# EAGLE design motorDriver (EAGLE 8.4.1)
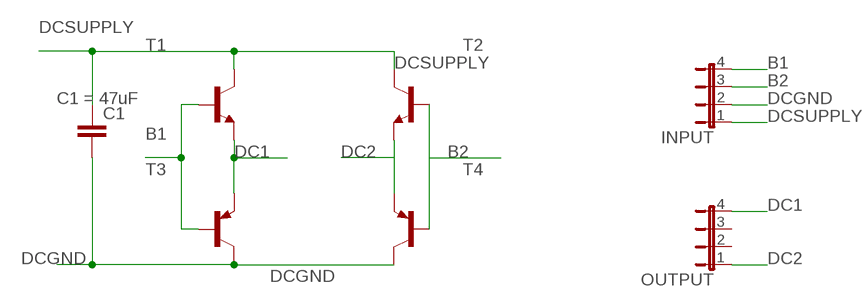
[diagram p0: schematic, sheet 1]

## Parts
C1  C5/3.5  [C5B3.5]
INPUT  JP4E  [JP4]
OUTPUT  JP4E  [JP4]
T1  -NPN-SOT93V  [SOT93V]
T2  -NPN-SOT93V  [SOT93V]
T3  -PNP-SOT93V  [SOT93V]
T4  -PNP-SOT93V  [SOT93V]

## Nets
B1: INPUT.4 T1.B T3.B
B2: INPUT.3 T2.B T4.B
DC1: OUTPUT.4 T1.E T3.E
DC2: OUTPUT.1 T2.E T4.E
DCGND: C1.2 INPUT.2 T3.C T4.C
DCSUPPLY: C1.1 INPUT.1 T1.C T2.C
Unconnected: OUTPUT.2 OUTPUT.3

## Library data of the parts
C1 = capacitor-wima:C: CAPACITOR naming: grid - package width; C1: 47uF
INPUT OUTPUT = jumper:JP4E: JUMPER
T1 T2 = transistor:*-NPN-: NPN Transistror BF959 corrected 2008.03.06
T3 T4 = transistor:*-PNP-: PNP Transistror

## Board
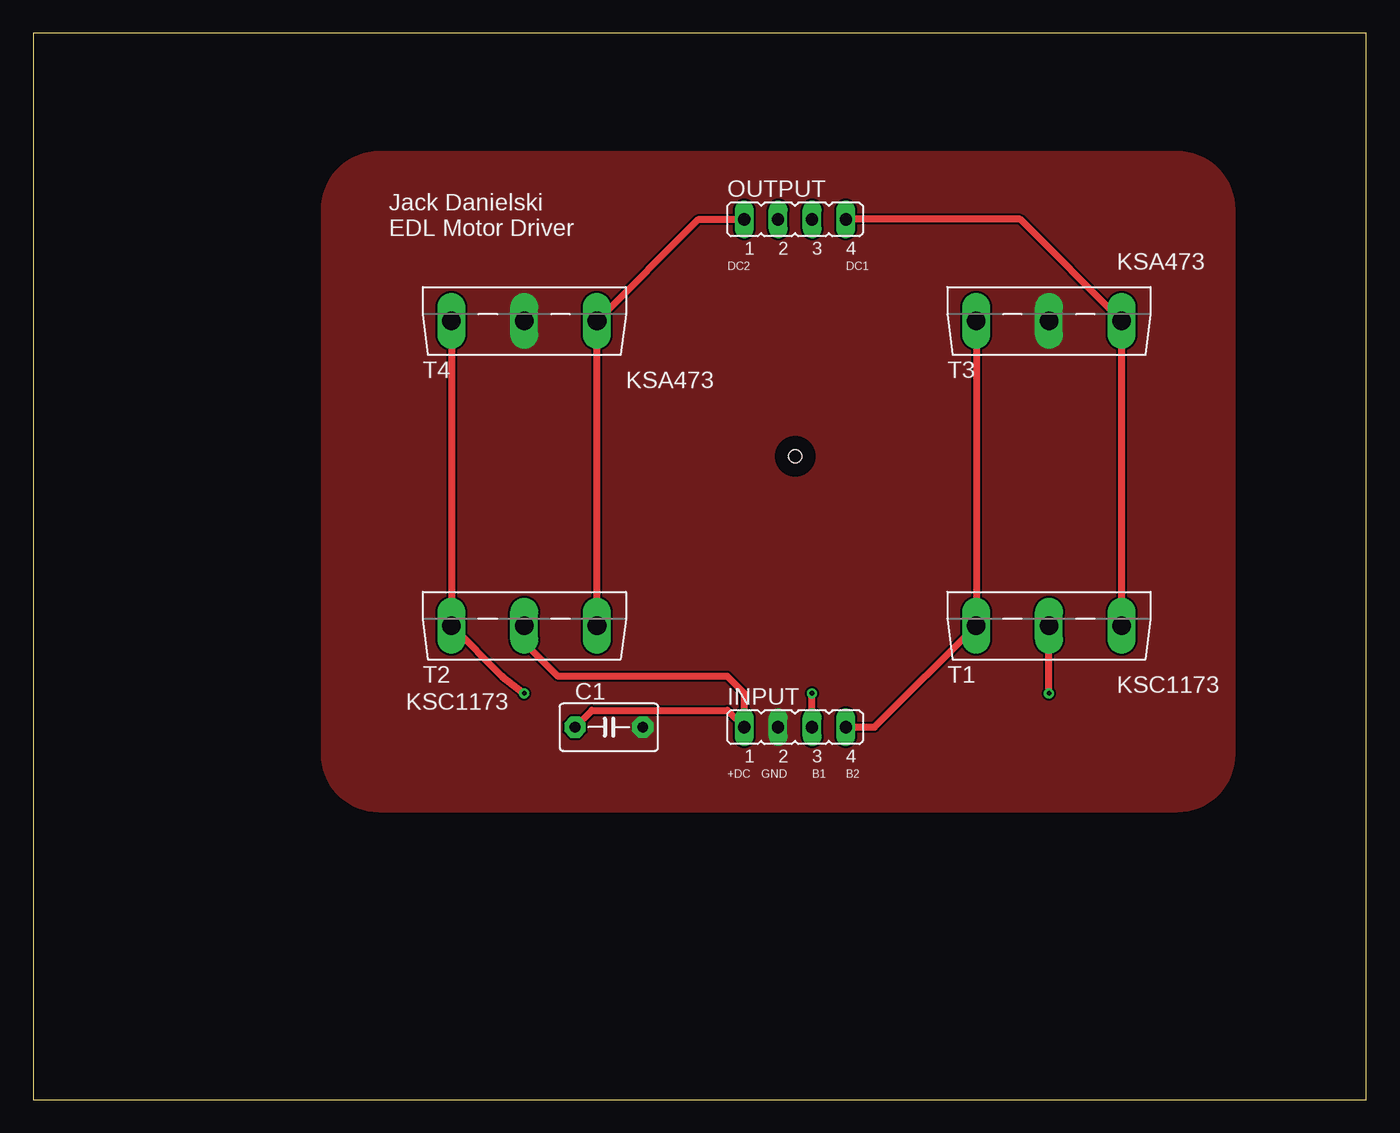
[diagram p1: board, top side]
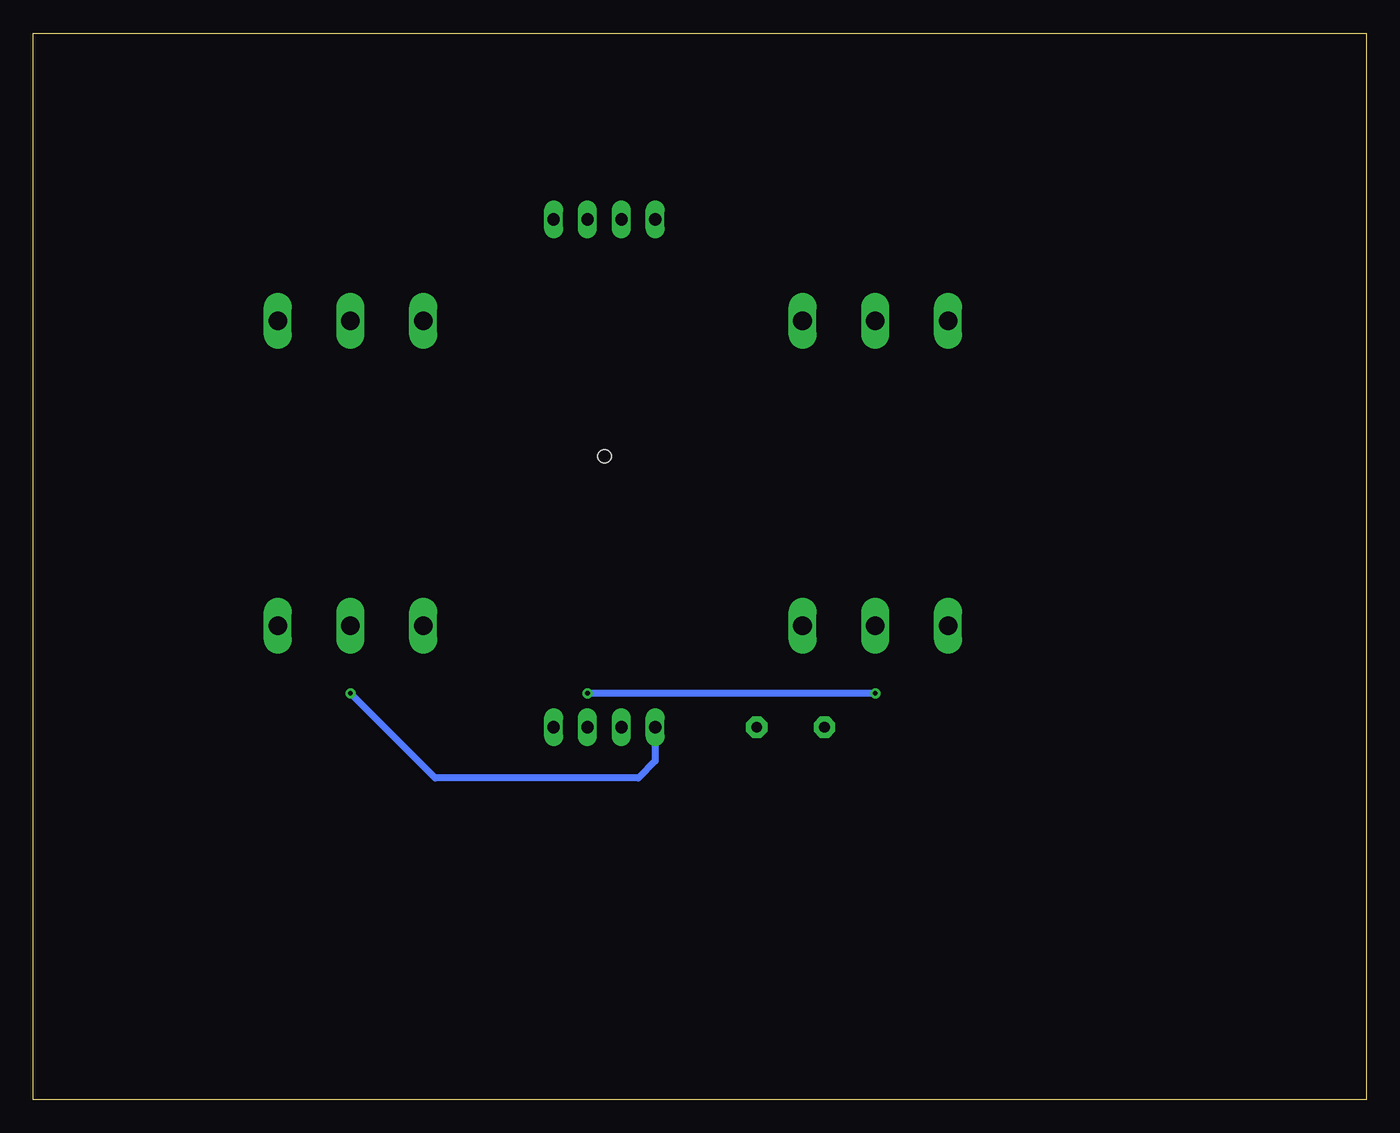
[diagram p2: board, bottom side, seen from below]

Size 100 x 80 mm. Coordinates in mm from the lower left corner, seen from the top.
Outline: 0,0 100,0 100,80 0,80 0,0
Copper layers (1*16): Top 0.035mm / dielectric 1.5mm / Bottom 0.035mm
Design rules "default": minimum track width 6mil, minimum drill 0.35mm, track to track 6mil, track to pad 6mil, pad to pad 6mil, via to via 6mil, smd to smd 6mil, copper to edge 40mil, drill to drill 6mil, minimum pad ring 10mil, minimum via ring 8mil, stop-mask expansion 4mil, vias tented up to drill 0mil, thermal gap 10mil
Holes 1 mm at 57.15,48.26

### Footprints (pad centres in the part's own frame; a part is rotated, then mirrored left to right if it is on the bottom)
C5B3.5 = drill 0.813 pad 1.6 octagon: 1 -2.54,0; 2 2.54,0
JP4 = drill 0.914 long: 1 -3.81,0; 2 -1.27,0; 3 1.27,0; 4 3.81,0
SOT93V = drill 1.397 long: B -5.461,-2.54; C 0,-2.54; E 5.461,-2.54

### Placement (x,y rotation side)
C1  43.18,27.94 0 top
INPUT  57.15,27.94 0 top
OUTPUT  57.15,66.04 0 top
T1  76.2,38.1 0 top
T2  36.83,38.1 0 top
T3  76.2,60.96 0 top
T4  36.83,60.96 0 top

### Tracks (layer width: path | path; a pad name or v marks a point on that pad's centre or on a via)
B1
  Top 0.508: INPUT.4 63.12,27.94 T1.B T3.B
B2  (via drill 0.35)
  Top 0.152: 35.18,31.75 v36.83,30.48
  Top 0.508: T4.B T2.B 35.18,31.75 v36.83,30.48 | INPUT.3 v58.42,30.48
  Bottom 0.508: v36.83,30.48 v58.42,30.48
DC1
  Top 0.508: OUTPUT.4 74.04,66.04 T3.E T1.E
DC2
  Top 0.508: T2.E T4.E 49.91,66.04 OUTPUT.1
DCGND
  pour Top (isolate 0.001, no thermals): 21.59,66.78 21.59,25.93 arc90 25.93,21.59 85.83,21.59 arc90 90.17,25.93 90.17,66.78 arc90 85.83,71.12 25.93,71.12 arc90
DCSUPPLY  (via drill 0.35)
  Top 0.508: C1.1 41.91,29.21 52.07,29.21 INPUT.1 53.34,30.48 52.07,31.75 39.37,31.75 36.83,34.29 T2.C | v76.2,30.48 T1.C
  Bottom 0.508: INPUT.1 53.34,25.4 54.61,24.13 69.85,24.13 v76.2,30.48

### Text on the board
tPlace: Jack Danielski / EDL Motor Driver | DC2 | DC1 | KSA473 | KSA473 | KSC1173 | KSC1173 | +DC | GND | B1 | B2